# Altium project led_heart.PrjPcb
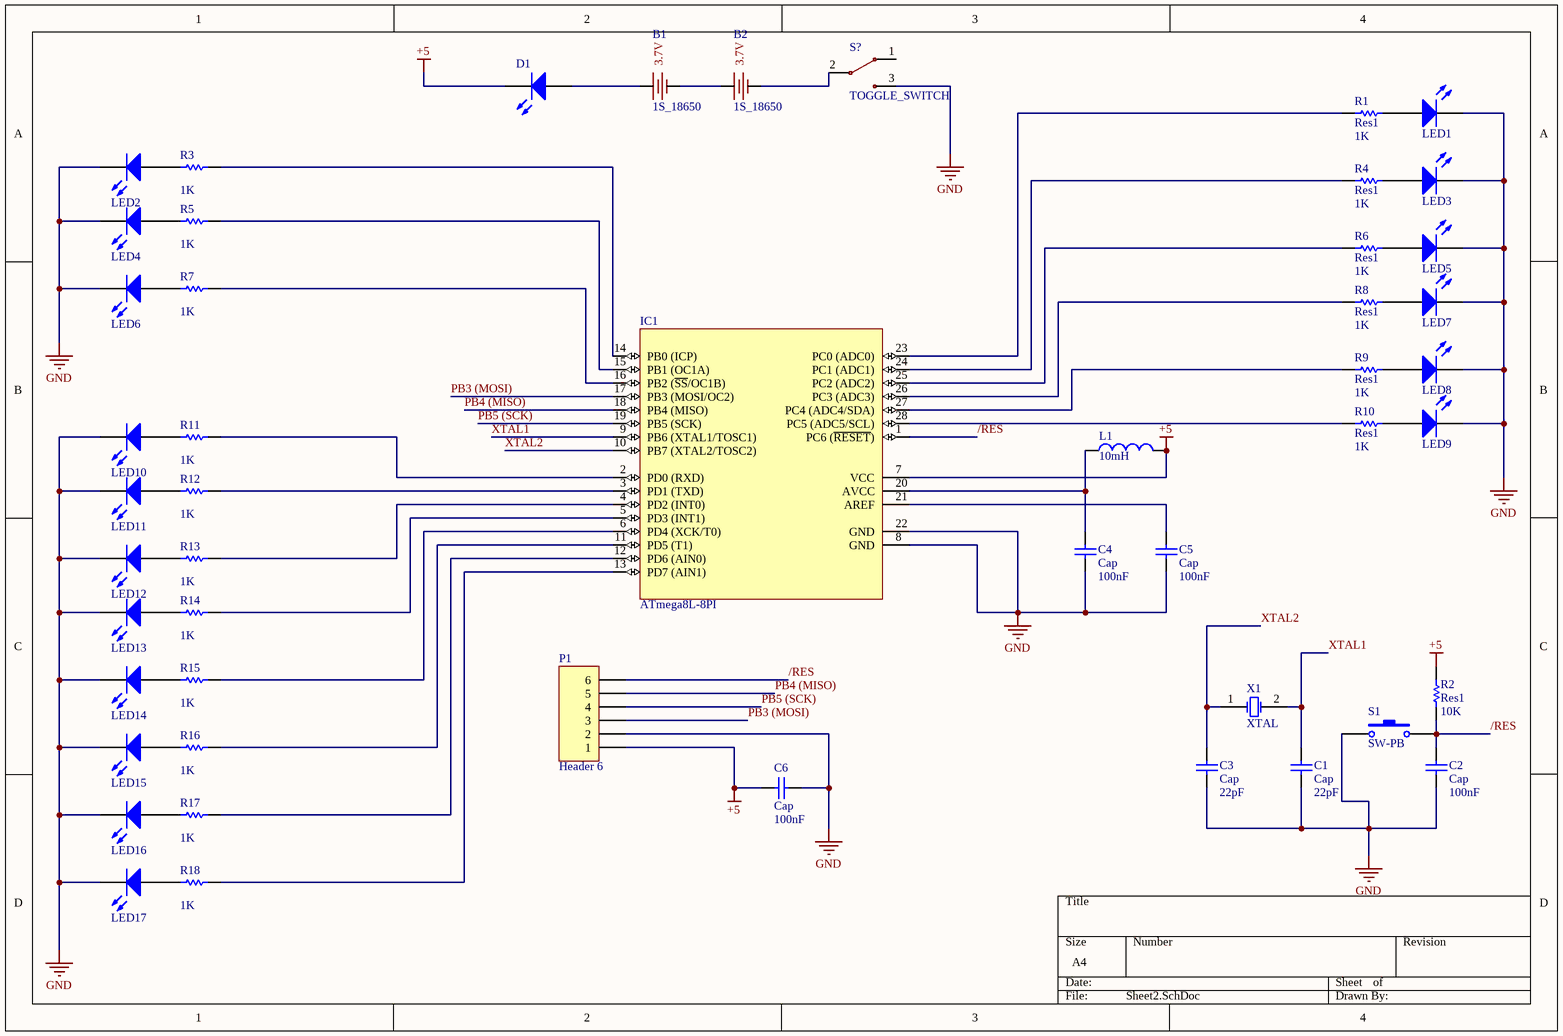
[diagram p0: Sheet2.SchDoc]
1 sheet, 50 parts. Net scope: global (net labels, ports and power ports of the same name join across sheets).
Board file: PCB_led_heart.PcbDoc

## Sheet Sheet2.SchDoc
size A4; SheetNumber: 1; SheetTotal: 1

### Parts
(Parts that share a designator on the sheet are numbered #1, #2 ... from top to bottom, then left to right.)
#1  LED1  [3.5X2.8X1.9]
#2  LED3  [3.5X2.8X1.9]
#3  LED2  [3.5X2.8X1.9]
#4  LED4  [3.5X2.8X1.9]
#5  LED5  [3.5X2.8X1.9]
#6  LED7  [3.5X2.8X1.9]
#7  LED6  [3.5X2.8X1.9]
#8  LED8  [3.5X2.8X1.9]
#9  LED9  [3.5X2.8X1.9]
#10  LED10  [3.5X2.8X1.9]
#11  LED11  [3.5X2.8X1.9]
#12  LED12  [3.5X2.8X1.9]
#13  LED13  [3.5X2.8X1.9]
#14  LED14  [3.5X2.8X1.9]
#15  LED15  [3.5X2.8X1.9]
#16  LED16  [3.5X2.8X1.9]
#17  LED17  [3.5X2.8X1.9]
B1  1S_18650  [1S_18650_PTH]
B2  1S_18650  [1S_18650_PTH]
C1  Cap  value 22pF  [RAD-0.3]
C2  Cap  value 100nF  [RAD-0.3]
C3  Cap  value 22pF  [RAD-0.3]
C4  Cap  value 100nF  [RAD-0.3]
C5  Cap  value 100nF  [RAD-0.3]
C6  Cap  value 100nF  [RAD-0.3]
D1  (no value)  [3.5X2.8X1.9]
IC1  ATmega8L-8PI  [28P3]
L1  value 10mH  [0402-A]
P1  Header 6  [HDR1X6]
R1  Res1  value 1K  [AXIAL-0.3]
R2  Res1  value 10K  [AXIAL-0.3]
R3  value 1K  [AXIAL-0.3]
R4  Res1  value 1K  [AXIAL-0.3]
R5  value 1K  [AXIAL-0.3]
R6  Res1  value 1K  [AXIAL-0.3]
R7  value 1K  [AXIAL-0.3]
R8  Res1  value 1K  [AXIAL-0.3]
R9  Res1  value 1K  [AXIAL-0.3]
R10  Res1  value 1K  [AXIAL-0.3]
R11  value 1K  [AXIAL-0.3]
R12  value 1K  [AXIAL-0.3]
R13  value 1K  [AXIAL-0.3]
R14  value 1K  [AXIAL-0.3]
R15  value 1K  [AXIAL-0.3]
R16  value 1K  [AXIAL-0.3]
R17  value 1K  [AXIAL-0.3]
R18  value 1K  [AXIAL-0.3]
S1  SW-PB  [SPST-2]
S?  TOGGLE_SWITCH  [TOGGLE_SWITCH_SPDT]
X1  XTAL  [R38]

### Nets
+5: C6.1 D1.2(K) IC1.7(VCC) L1.2 P1.1 R2.2
GND: #1.2(K) #2.2(K) #3.2(K) #4.2(K) #5.2(K) #6.2(K) #7.2(K) #8.2(K) #9.2(K) #10.2(K) #11.2(K) #12.2(K) #13.2(K) #14.2(K) #15.2(K) #16.2(K) #17.2(K) C1.1 C2.1 C3.1 C4.1 C5.1 C6.2 IC1.8(GND) IC1.22(GND) P1.2 S1.1 S?.3
/RES: C2.2 IC1.1(PC6_(~{RESET})) P1.6 R2.1 S1.2
PB3 (MOSI): IC1.17(PB3_(MOSI/OC2)) P1.3
PB4 (MISO): IC1.18(PB4_(MISO)) P1.5
PB5 (SCK): IC1.19(PB5_(SCK)) P1.4
XTAL1: C1.2 IC1.9(PB6_(XTAL1/TOSC1)) X1.2(OSC2)
XTAL2: C3.2 IC1.10(PB7_(XTAL2/TOSC2)) X1.1(OSC1)
Net#1_1: #1.1(A) R1.2
Net#2_1: #2.1(A) R4.2
Net#3_1: #3.1(A) R3.1
Net#4_1: #4.1(A) R5.1
Net#5_1: #5.1(A) R6.2
Net#6_1: #6.1(A) R8.2
Net#7_1: #7.1(A) R7.1
Net#8_1: #8.1(A) R9.2
Net#9_1: #9.1(A) R10.2
Net#10_1: #10.1(A) R11.1
Net#11_1: #11.1(A) R12.1
Net#12_1: #12.1(A) R13.1
Net#13_1: #13.1(A) R14.1
Net#14_1: #14.1(A) R15.1
Net#15_1: #15.1(A) R16.1
Net#16_1: #16.1(A) R17.1
Net#17_1: #17.1(A) R18.1
NetB1_1: B1.1 D1.1(A)
NetB1_2: B1.2 B2.1
NetB2_2: B2.2 S?.2
NetC4_2: C4.2 IC1.20(AVCC) L1.1
NetC5_2: C5.2 IC1.21(AREF)
NetIC1_2: IC1.2(PD0_(RXD)) R11.2
NetIC1_3: IC1.3(PD1_(TXD)) R12.2
NetIC1_4: IC1.4(PD2_(INT0)) R13.2
NetIC1_5: IC1.5(PD3_(INT1)) R14.2
NetIC1_6: IC1.6(PD4_(XCK/T0)) R15.2
NetIC1_11: IC1.11(PD5_(T1)) R16.2
NetIC1_12: IC1.12(PD6_(AIN0)) R17.2
NetIC1_13: IC1.13(PD7_(AIN1)) R18.2
NetIC1_14: IC1.14(PB0_(ICP)) R3.2
NetIC1_15: IC1.15(PB1_(OC1A)) R5.2
NetIC1_16: IC1.16(PB2_(~{SS}/OC1B)) R7.2
NetIC1_23: IC1.23(PC0_(ADC0)) R1.1
NetIC1_24: IC1.24(PC1_(ADC1)) R4.1
NetIC1_25: IC1.25(PC2_(ADC2)) R6.1
NetIC1_26: IC1.26(PC3_(ADC3)) R8.1
NetIC1_27: IC1.27(PC4_(ADC4/SDA)) R9.1
NetIC1_28: IC1.28(PC5_(ADC5/SCL)) R10.1

Not connected (* = marked no-connect by the designer): S? 1

### Notes on the sheet
- (in symbol 1S_18650) 3.7V

### Library data of the parts
#1-#17 D1 = LED3: Typical BLUE SiC LED
B1 B2 = 1S_18650: Battery 18650 Holder for 1 Cell, SMD or PTH Version
C1-C6 = Cap: Capacitor; Published: 8-Jun-2000; LatestRevisionDate: 17-Jul-2002; LatestRevisionNote: Re-released for DXP Platform.; PackageReference: RAD-0.3; Publisher: Altium Limited; PackageDescription: Radial Cap, Thru-Hole; 2 Leads; 0.3 in Pin Spacing
IC1 = ATmega8L-8PI: 8-Bit AVR Microcontroller with 8K Bytes of In-System Programmable Flash Memory; Published: 17-Sep-2003; DatasheetVersion: 2486H-AVR-09/02; PackageVersion: revB, Sep-2001; PackageReference: 28P3; Publisher: Altium Limited; PackageDescription: 28-lead (0.300"/7.62mm Wide) Plastic Dual Inline Package (PDIP); Supplier 1: Digi-Key; Supplier Part Number 1: ATMEGA8L-8PI-ND; Supplier 2: Farnell; Supplier Part Number 2: 3917940; Supplier 3: Mouser; Supplier Part Number 3: 556-ATMEGA8L-8PI; ComponentLink1Description: Datasheet; ComponentLink1URL: http://www.atmel.com/dyn/resources/prod_documents/doc2486.pdf; ComponentLink2Description: Atmel.com Home; ComponentLink2URL: http://www.atmel.com
L1 = Inductor: Code_IEC: 1005; Published: 8-Jun-2000; LatestRevisionDate: 29-May-2009; LatestRevisionNote: IPC-7351 Footprint Added.; PackageReference: 0402-A; Publisher: Altium Limited; PackageDescription: Chip Inductor; Code_JEITA: 0402
P1 = Header 6: Header, 6-Pin; LatestRevisionDate: 17-Jul-2002; LatestRevisionNote: Re-released for DXP Platform.; Publisher: Altium Limited
R1-R18 = Res1: Resistor; Published: 8-Jun-2000; LatestRevisionDate: 17-Jul-2002; LatestRevisionNote: Re-released for DXP Platform.; PackageReference: AXIAL-0.3; Publisher: Altium Limited; PackageDescription: Axial Device, Thru-Hole; 2 Leads; 0.3 in Pin Spacing
S1 = SW-PB: Switch; Published: 24-Mar-1999; LatestRevisionDate: 17-Jul-2002; LatestRevisionNote: Re-released for DXP Platform.; PackageReference: SPST-2; Publisher: Altium Limited; PackageDescription: Switch; 2 Leads
S? = TOGGLE_SWITCH_SPDT: Toggle Switch SPDT, 125V AC, 6A, 33x13x7mm.; JLCPCB PN: C2921493
X1 = XTAL: Crystal Oscillator; Published: 8-Jun-2000; LatestRevisionDate: 17-Jul-2002; LatestRevisionNote: Re-released for DXP Platform.; PackageReference: R38; Publisher: Altium Limited; PackageDescription: Crystal, Thru-Hole; 2 Leads; Body 3.1 x 8.2 mm (Dia.xH)